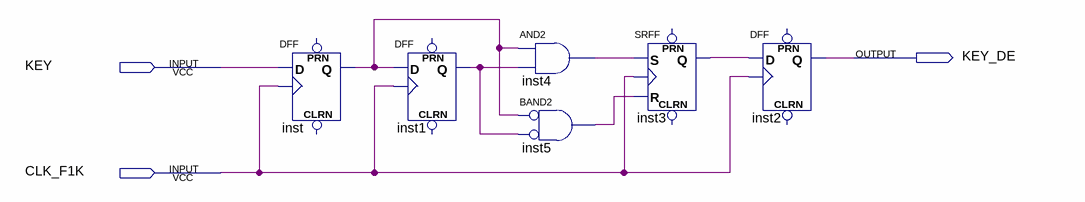
[diagram p0: schematic sheet]
// Quartus schematic KEY_DEBOUNCE.bdf as structural Verilog: 6 symbols, 3 pins
module KEY_DEBOUNCE (
  input  KEY,
  input  CLK_F1K,
  output KEY_DE
);

  wire inst1_q, inst3_q, inst4_out, inst5_out, inst_q;

  DFF inst (.CLK(CLK_F1K), .D(KEY), .Q(inst_q));  // open: CLRN, PRN
  DFF inst1 (.CLK(CLK_F1K), .D(inst_q), .Q(inst1_q));  // open: CLRN, PRN
  and inst4 (inst4_out, inst_q, inst1_q);
  and inst5 (inst5_out, ~inst_q, ~inst1_q);  // BAND2
  SRFF inst3 (.S(inst4_out), .R(inst5_out), .CLK(CLK_F1K), .Q(inst3_q));  // open: PRN, CLRN
  DFF inst2 (.CLK(CLK_F1K), .D(inst3_q), .Q(KEY_DE));  // open: CLRN, PRN
endmodule
